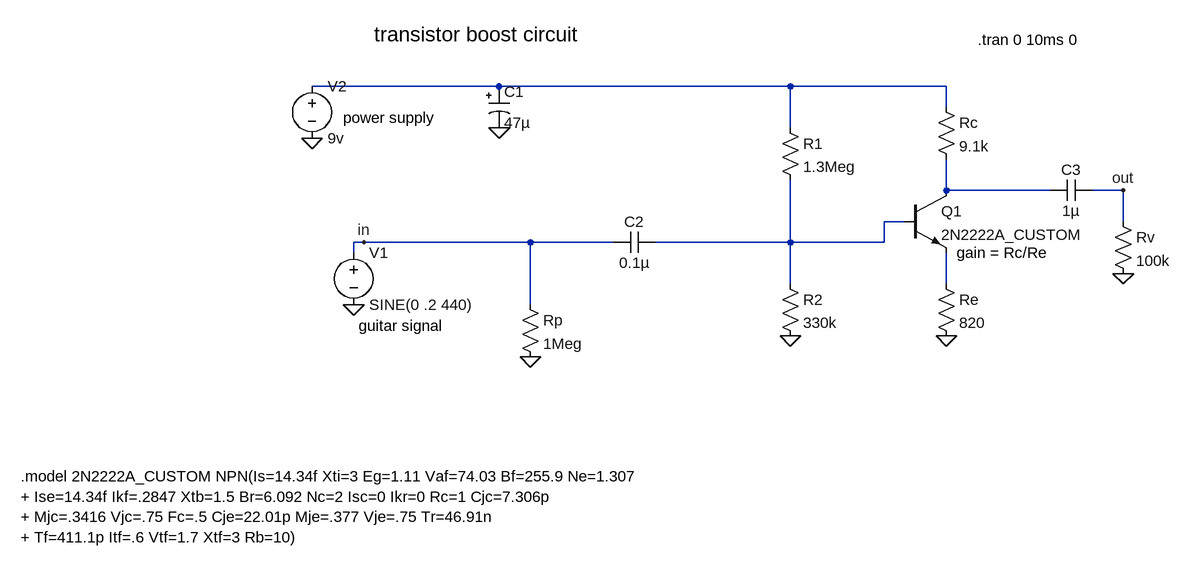
[diagram p0: schematic transistor_boost.asc]
transistor_boost.asc, the LTspice schematic file:
Version 4
SHEET 1 1380 680
WIRE 208 -128 -80 -128
WIRE 656 -128 208 -128
WIRE 896 -128 656 -128
WIRE 896 -96 896 -128
WIRE 656 -64 656 -128
WIRE 896 32 896 -16
WIRE 1056 32 896 32
WIRE 1168 32 1120 32
WIRE 832 80 800 80
WIRE 1168 80 1168 32
WIRE 0 112 -16 112
WIRE 256 112 0 112
WIRE 384 112 256 112
WIRE 656 112 656 16
WIRE 656 112 448 112
WIRE 800 112 800 80
WIRE 800 112 656 112
WIRE -16 128 -16 112
WIRE 656 176 656 112
WIRE 896 176 896 128
WIRE 256 208 256 112
FLAG 208 -64 0
FLAG -80 -48 0
FLAG -16 208 0
FLAG 256 288 0
FLAG 656 256 0
FLAG 896 256 0
FLAG 1168 160 0
FLAG 1168 32 out
FLAG 0 112 in
SYMBOL voltage -16 112 R0
WINDOW 123 0 0 Left 0
WINDOW 39 0 0 Left 0
SYMATTR InstName V1
SYMATTR Value SINE(0 .2 440)
SYMBOL res 240 192 R0
SYMATTR InstName Rp
SYMATTR Value 1Meg
SYMBOL res 640 -80 R0
SYMATTR InstName R1
SYMATTR Value 1.3Meg
SYMBOL res 640 160 R0
SYMATTR InstName R2
SYMATTR Value 330k
SYMBOL res 880 160 R0
SYMATTR InstName Re
SYMATTR Value 820
SYMBOL res 880 -112 R0
SYMATTR InstName Rc
SYMATTR Value 9.1k
SYMBOL res 1152 64 R0
SYMATTR InstName Rv
SYMATTR Value 100k
SYMBOL cap 448 96 R90
WINDOW 0 0 32 VBottom 2
WINDOW 3 32 32 VTop 2
SYMATTR InstName C2
SYMATTR Value 0.1µ
SYMBOL cap 1120 16 R90
WINDOW 0 0 32 VBottom 2
WINDOW 3 32 32 VTop 2
SYMATTR InstName C3
SYMATTR Value 1µ
SYMBOL polcap 192 -128 R0
SYMATTR InstName C1
SYMATTR Value 47µ
SYMBOL voltage -80 -144 R0
WINDOW 123 0 0 Left 0
WINDOW 39 0 0 Left 0
SYMATTR InstName V2
SYMATTR Value 9v
SYMBOL npn2 832 32 R0
SYMATTR InstName Q1
SYMATTR Value 2N2222A_CUSTOM
TEXT 16 -208 Left 3 !transistor boost circuit
TEXT -8 240 Left 2 !guitar signal
TEXT -32 -80 Left 2 !power supply
TEXT 912 128 Left 2 !gain = Rc/Re
TEXT 944 -200 Left 2 !.tran 0 10ms 0
TEXT -528 472 Left 2 !.model 2N2222A_CUSTOM NPN(Is=14.34f Xti=3 Eg=1.11 Vaf=74.03 Bf=255.9 Ne=1.307\n+ Ise=14.34f Ikf=.2847 Xtb=1.5 Br=6.092 Nc=2 Isc=0 Ikr=0 Rc=1 Cjc=7.306p\n+ Mjc=.3416 Vjc=.75 Fc=.5 Cje=22.01p Mje=.377 Vje=.75 Tr=46.91n\n+ Tf=411.1p Itf=.6 Vtf=1.7 Xtf=3 Rb=10)

The netlist it stands for:
* transistor_boost.asc
V1 in 0 SINE(0 .2 440)
Rp in 0 1Meg
R1 N001 N003 1.3Meg
R2 N003 0 330k
Re N004 0 820
Rc N001 N002 9.1k
Rv out 0 100k
C2 N003 in 0.1µ
C3 out N002 1µ
C1 N001 0 47µ
V2 N001 0 9v
Q1 N002 N003 N004 0 2N2222A_CUSTOM
.model NPN NPN
.model PNP PNP
.lib standard.bjt
transistor boost circuit
guitar signal
power supply
gain = Rc/Re
.tran 0 10ms 0
.model 2N2222A_CUSTOM NPN(Is=14.34f Xti=3 Eg=1.11 Vaf=74.03 Bf=255.9 Ne=1.307
+ Ise=14.34f Ikf=.2847 Xtb=1.5 Br=6.092 Nc=2 Isc=0 Ikr=0 Rc=1 Cjc=7.306p
+ Mjc=.3416 Vjc=.75 Fc=.5 Cje=22.01p Mje=.377 Vje=.75 Tr=46.91n
+ Tf=411.1p Itf=.6 Vtf=1.7 Xtf=3 Rb=10)
.backanno
.end